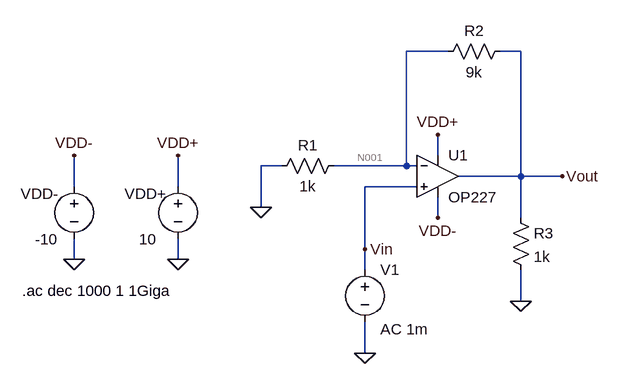
[diagram p0: schematic q4.asc]
q4.asc, the LTspice schematic file:
Version 4.1
SHEET 1 880 680
WIRE 208 -32 144 -32
WIRE 320 -32 288 -32
WIRE 192 128 192 96
WIRE -48 144 -80 144
WIRE 144 144 144 -32
WIRE 144 144 32 144
WIRE 160 144 144 144
WIRE 320 160 320 -32
WIRE 320 160 224 160
WIRE 384 160 320 160
WIRE -368 176 -368 128
WIRE -208 176 -208 128
WIRE 160 176 80 176
WIRE -80 208 -80 144
WIRE 192 224 192 192
WIRE 320 224 320 160
WIRE 80 272 80 176
WIRE -368 288 -368 256
WIRE -208 288 -208 256
WIRE 80 304 80 272
WIRE 320 352 320 304
WIRE 80 432 80 384
FLAG -368 288 0
FLAG 384 160 Vout
FLAG 80 272 Vin
FLAG -208 288 0
FLAG -368 128 VDD-
FLAG -208 128 VDD+
FLAG 192 96 VDD+
FLAG 192 224 VDD-
FLAG 80 432 0
FLAG 320 352 0
FLAG -80 208 0
SYMBOL voltage -368 160 R0
WINDOW 0 -82 27 Left 2
WINDOW 3 -60 97 Left 2
WINDOW 123 0 0 Left 0
WINDOW 39 0 0 Left 0
SYMATTR InstName VDD-
SYMATTR Value -10
SYMBOL voltage -208 160 R0
WINDOW 0 -82 27 Left 2
WINDOW 3 -60 97 Left 2
WINDOW 123 0 0 Left 0
WINDOW 39 0 0 Left 0
SYMATTR InstName VDD+
SYMATTR Value 10
SYMBOL OpAmps\\OP227 192 96 R0
SYMATTR InstName U1
SYMBOL res 304 -48 R90
WINDOW 0 0 56 VBottom 2
WINDOW 3 32 56 VTop 2
SYMATTR InstName R2
SYMATTR Value 9k
SYMBOL voltage 80 288 R0
WINDOW 123 24 107 Left 2
WINDOW 39 0 0 Left 0
SYMATTR InstName V1
SYMATTR Value ""
SYMATTR Value2 AC 1m
SYMBOL res 48 128 R90
WINDOW 0 0 56 VBottom 2
WINDOW 3 32 56 VTop 2
SYMATTR InstName R1
SYMATTR Value 1k
SYMBOL res 304 208 R0
SYMATTR InstName R3
SYMATTR Value 1k
TEXT -448 336 Left 2 !.ac dec 1000 1 1Giga

The netlist it stands for:
* q4.asc
VDD- VDD- 0 -10
VDD+ VDD+ 0 10
X§U1 Vin N001 VDD+ VDD- Vout OP227  ; pins In+ In- V+ V- OUT
R2 Vout N001 9k
V1 Vin 0 AC 1m
R1 N001 0 1k
R3 Vout 0 1k
.ac dec 1000 1 1Giga
.backanno
.end

* Results of the author's LTspice run, read from the files saved beside the schematic
* Operating Point, zero values left out:
*   V(vdd+) = 10 V
*   V(vdd-) = -10 V
*   I(VDD-) = 2.718 mA
*   I(VDD+) = -2.718 mA
*   Ix(u1:3) = 2.718 mA
*   Ix(u1:4) = -2.718 mA
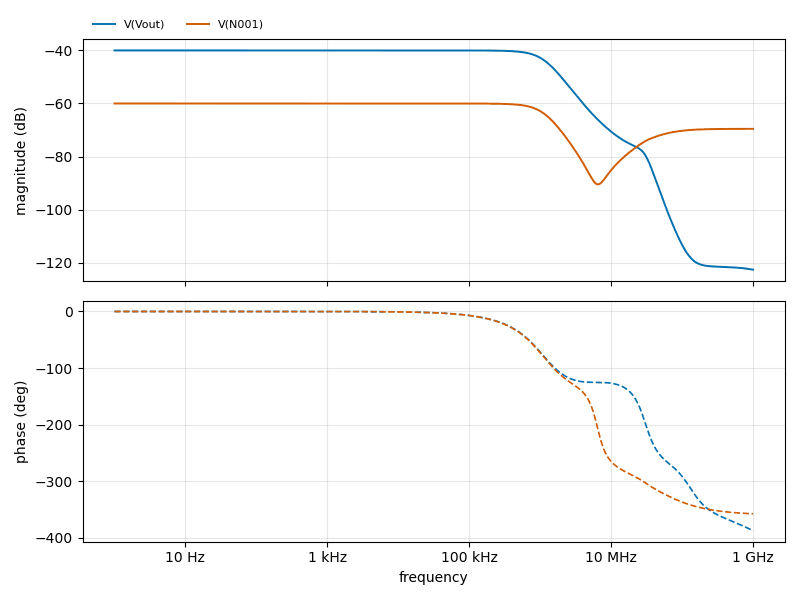
[diagram p1: AC Analysis of q4.asc, plotted from the saved traces]
* AC Analysis, 1 run:
*   V(Vout): -40.00 dB at 1 Hz, -122.64 dB at 1 GHz, peak -40.00 dB at 1 Hz, 3 dB below the peak at 1.034 MHz
*   V(N001): -60.00 dB at 1 Hz, -69.55 dB at 1 GHz, peak -60.00 dB at 1 Hz, 3 dB below the peak at 1.02 MHz